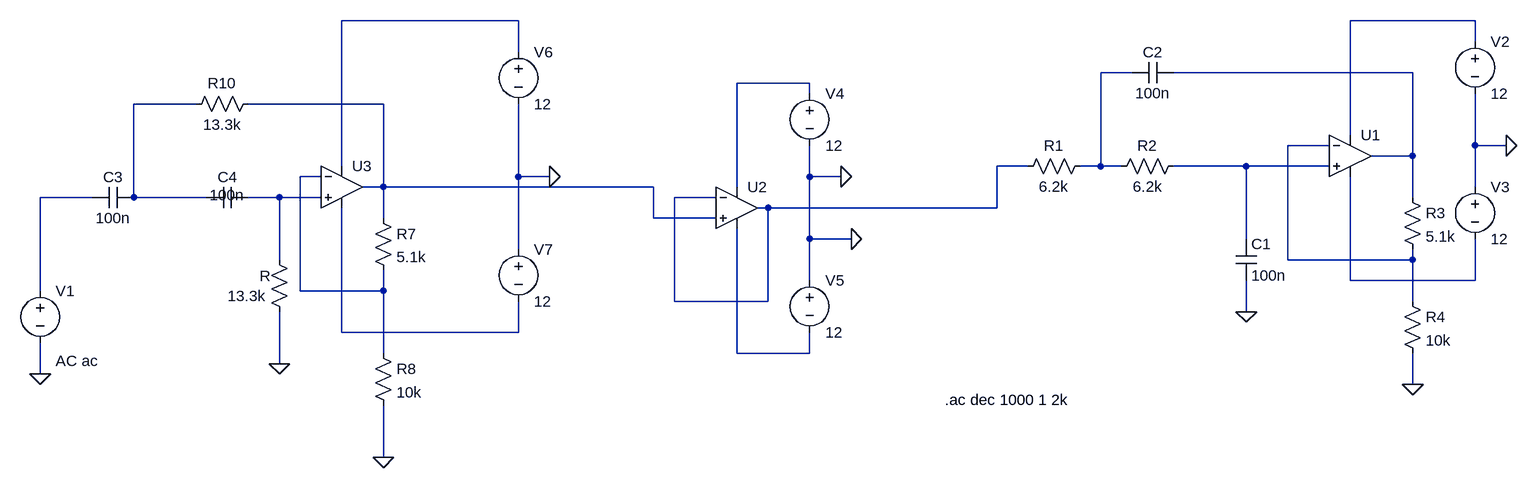
[diagram p0: schematic Draft1.asc]
Draft1.asc, the LTspice schematic file:
Version 4
SHEET 1 1912 680
WIRE -800 -192 -1072 -192
WIRE 672 -192 480 -192
WIRE 672 -160 672 -192
WIRE -800 -144 -800 -192
WIRE 144 -112 96 -112
WIRE 576 -112 208 -112
WIRE -352 -96 -464 -96
WIRE -352 -80 -352 -96
WIRE -1296 -64 -1392 -64
WIRE -1008 -64 -1216 -64
WIRE 480 -16 480 -192
WIRE 448 0 384 0
WIRE 672 0 672 -80
WIRE 720 0 672 0
WIRE 576 16 576 -112
WIRE 576 16 512 16
WIRE -1072 32 -1072 -192
WIRE -16 32 -64 32
WIRE 96 32 96 -112
WIRE 96 32 64 32
WIRE 128 32 96 32
WIRE 320 32 208 32
WIRE 448 32 320 32
WIRE -1104 48 -1136 48
WIRE -800 48 -800 -64
WIRE -752 48 -800 48
WIRE -352 48 -352 0
WIRE -304 48 -352 48
WIRE -1008 64 -1008 -64
WIRE -1008 64 -1040 64
WIRE -592 64 -1008 64
WIRE -464 64 -464 -96
WIRE 672 64 672 0
WIRE -1456 80 -1536 80
WIRE -1392 80 -1392 -64
WIRE -1280 80 -1392 80
WIRE -1168 80 -1216 80
WIRE -1104 80 -1168 80
WIRE -496 80 -560 80
WIRE 576 80 576 16
WIRE -416 96 -432 96
WIRE -64 96 -64 32
WIRE -64 96 -416 96
WIRE -1008 112 -1008 64
WIRE -592 112 -592 64
WIRE -496 112 -592 112
WIRE -352 144 -352 48
WIRE -288 144 -352 144
WIRE 320 144 320 32
WIRE -800 160 -800 48
WIRE -1168 176 -1168 80
WIRE 384 176 384 0
WIRE 576 176 576 160
WIRE 576 176 384 176
WIRE -352 208 -352 144
WIRE 480 208 480 48
WIRE 672 208 672 144
WIRE 672 208 480 208
WIRE -1536 224 -1536 80
WIRE -1136 224 -1136 48
WIRE -1008 224 -1008 192
WIRE -1008 224 -1136 224
WIRE -560 240 -560 80
WIRE -416 240 -416 96
WIRE -416 240 -560 240
WIRE 576 240 576 176
WIRE 320 256 320 208
WIRE -1072 288 -1072 96
WIRE -800 288 -800 240
WIRE -800 288 -1072 288
WIRE -1008 320 -1008 224
WIRE -464 320 -464 128
WIRE -352 320 -352 288
WIRE -352 320 -464 320
WIRE -1168 336 -1168 256
WIRE -1536 352 -1536 304
WIRE 576 368 576 320
WIRE -1008 480 -1008 400
FLAG -1536 352 0
FLAG 320 256 0
FLAG 576 368 0
FLAG 720 0 0
FLAG -1168 336 0
FLAG -1008 480 0
FLAG -752 48 0
FLAG -304 48 0
FLAG -288 144 0
DATAFLAG -400 320 ""
SYMBOL res 80 16 R90
WINDOW 0 0 56 VBottom 2
WINDOW 3 32 56 VTop 2
SYMATTR InstName R1
SYMATTR Value 6.2k
SYMBOL res 224 16 R90
WINDOW 0 0 56 VBottom 2
WINDOW 3 32 56 VTop 2
SYMATTR InstName R2
SYMATTR Value 6.2k
SYMBOL voltage -1536 208 R0
WINDOW 123 24 124 Left 2
WINDOW 39 0 0 Left 0
SYMATTR Value2 AC ac
SYMATTR InstName V1
SYMATTR Value ""
SYMBOL OpAmps\\UniversalOpAmp 480 16 R0
SYMATTR InstName U1
SYMBOL voltage 672 -176 R0
WINDOW 123 0 0 Left 0
WINDOW 39 0 0 Left 0
SYMATTR InstName V2
SYMATTR Value 12
SYMBOL voltage 672 48 R0
WINDOW 123 0 0 Left 0
WINDOW 39 0 0 Left 0
SYMATTR InstName V3
SYMATTR Value 12
SYMBOL cap 304 144 R0
SYMATTR InstName C1
SYMATTR Value 100n
SYMBOL cap 208 -128 R90
WINDOW 0 0 32 VBottom 2
WINDOW 3 32 32 VTop 2
SYMATTR InstName C2
SYMATTR Value 100n
SYMBOL res 560 64 R0
SYMATTR InstName R3
SYMATTR Value 5.1k
SYMBOL res 560 224 R0
SYMATTR InstName R4
SYMATTR Value 10k
SYMBOL OpAmps\\UniversalOpAmp -464 96 R0
SYMATTR InstName U2
SYMBOL voltage -352 -96 R0
WINDOW 123 0 0 Left 0
WINDOW 39 0 0 Left 0
SYMATTR InstName V4
SYMATTR Value 12
SYMBOL voltage -352 192 R0
WINDOW 123 0 0 Left 0
WINDOW 39 0 0 Left 0
SYMATTR InstName V5
SYMATTR Value 12
SYMBOL cap -1392 64 R90
WINDOW 0 0 32 VBottom 2
WINDOW 3 32 32 VTop 2
SYMATTR InstName C3
SYMATTR Value 100n
SYMBOL cap -1216 64 R90
WINDOW 0 0 32 VBottom 2
WINDOW 3 28 32 VBottom 2
SYMATTR InstName C4
SYMATTR Value 100n
SYMBOL res -1200 -80 R90
WINDOW 0 0 56 VBottom 2
WINDOW 3 32 56 VTop 2
SYMATTR InstName R10
SYMATTR Value 13.3k
SYMBOL res -1152 272 R180
WINDOW 0 29 71 Left 2
WINDOW 3 36 40 Left 2
SYMATTR InstName R
SYMATTR Value 13.3k
SYMBOL OpAmps\\UniversalOpAmp -1072 64 R0
SYMATTR InstName U3
SYMBOL res -1024 96 R0
SYMATTR InstName R7
SYMATTR Value 5.1k
SYMBOL res -1024 304 R0
SYMATTR InstName R8
SYMATTR Value 10k
SYMBOL voltage -800 -160 R0
WINDOW 123 0 0 Left 0
WINDOW 39 0 0 Left 0
SYMATTR InstName V6
SYMATTR Value 12
SYMBOL voltage -800 144 R0
WINDOW 123 0 0 Left 0
WINDOW 39 0 0 Left 0
SYMATTR InstName V7
SYMATTR Value 12
TEXT -144 392 Left 2 !.ac dec 1000 1 2k

The netlist it stands for:
* Draft1.asc
R1 N003 N009 6.2k
R2 N010 N003 6.2k
V1 N012 0 AC ac
XU1 N010 N008 N002 N014 N004 level1 Avol=1Meg GBW=10Meg Vos=0 En=0 Enk=0 In=0 Ink=0 Rin=500Meg  ; pins In+ In- V+ V- OUT
V2 N002 0 12
V3 0 N014 12
C1 N010 0 100n
C2 N004 N003 100n
R3 N004 N008 5.1k
R4 N008 0 10k
XU2 N007 N009 N005 N016 N009 level1 Avol=1Meg GBW=10Meg Vos=0 En=0 Enk=0 In=0 Ink=0 Rin=500Meg  ; pins In+ In- V+ V- OUT
V4 N005 0 12
V5 0 N016 12
C3 N006 N012 100n
C4 N013 N006 100n
R10 N007 N006 13.3k
R 0 N013 13.3k
XU3 N013 N011 N001 N015 N007 level1 Avol=1Meg GBW=10Meg Vos=0 En=0 Enk=0 In=0 Ink=0 Rin=500Meg  ; pins In+ In- V+ V- OUT
R7 N007 N011 5.1k
R8 N011 0 10k
V6 N001 0 12
V7 0 N015 12
.ac dec 1000 1 2k
.lib UniversalOpAmp1.lib
.backanno
.end